# Altium schematic sheet rendszerterv.SchDoc
size A
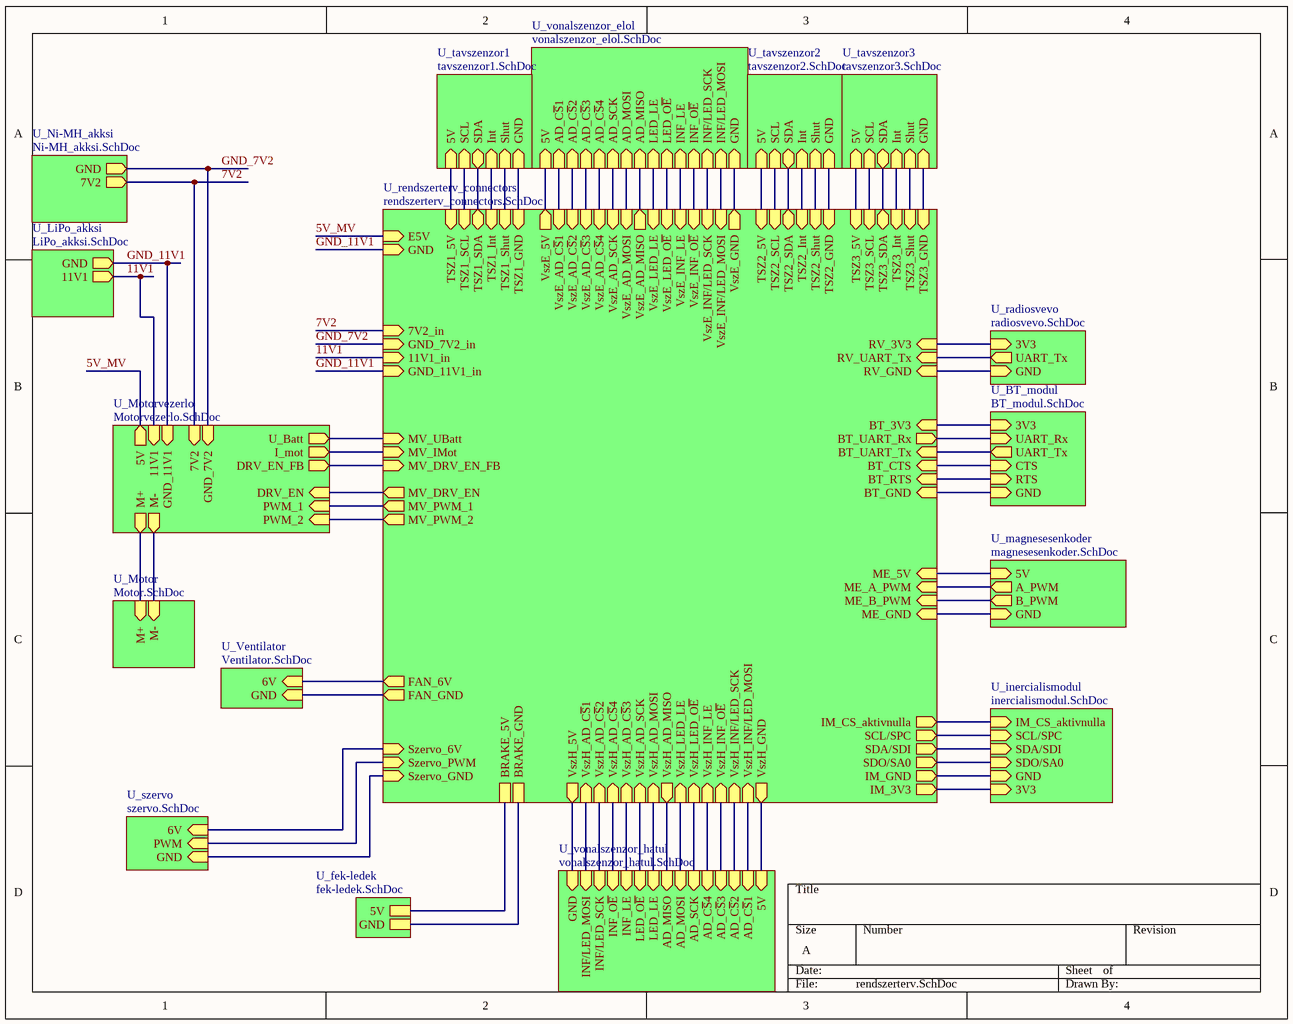
[diagram p0: rendszerterv.SchDoc]

## Sub-sheets
U_BT_modul = BT_modul.SchDoc: UART_Tx (out), UART_Rx (in), 3V3 (in), GND (in), CTS (in), RTS (in)
U_fek-ledek = fek-ledek.SchDoc: 5V, GND
U_inercialismodul = inercialismodul.SchDoc: IM_CS_aktivnulla (in), SCL/SPC (in), SDA/SDI (in), SDO/SA0 (in), GND (in), 3V3 (in)
U_LiPo_akksi = LiPo_akksi.SchDoc: GND (out), 11V1 (out)
U_magnesesenkoder = magnesesenkoder.SchDoc: 5V (in), GND (in), A_PWM (out), B_PWM (out)
U_Motor = Motor.SchDoc: M+ (in), M- (in)
U_Motorvezerlo = Motorvezerlo.SchDoc: 7V2 (in), GND_7V2 (in), 11V1 (in), GND_11V1 (in), 5V (out), U_Batt (out), I_mot (out), DRV_EN_FB (out), DRV_EN (in), PWM_1 (in), PWM_2 (in), M+ (out), M- (out)
U_Ni-MH_akksi = Ni-MH_akksi.SchDoc: 7V2 (out), GND (out)
U_radiosvevo = radiosvevo.SchDoc: 3V3 (in), GND (in), UART_Tx (out)
U_rendszerterv_connectors = rendszerterv_connectors.SchDoc: E5V (in), GND (in), MV_DRV_EN (out), MV_PWM_1 (out), MV_PWM_2 (out), MV_UBatt (in), MV_IMot (in), MV_DRV_EN_FB (in), FAN_6V (out), Szervo_PWM (in), Szervo_GND (in), ME_5V (in), ME_GND (in), ME_A_PWM (in), ME_B_PWM (in), Szervo_6V (in), VszE_5V (out), VszE_AD_C~{S}1 (in), VszE_AD_C~{S}2 (in), VszE_AD_C~{S}3 (in), VszE_AD_C~{S}4 (in), VszE_AD_SCK (in), VszE_AD_MOSI (in), VszE_AD_MISO (out), VszE_LED_LE (in), VszE_LED_O~{E} (in), VszE_INF_LE (in), VszE_INF_O~{E} (in), VszE_INF/LED_SCK (in), VszE_INF/LED_MOSI (in), TSZ1_5V (in), TSZ1_GND (in), TSZ1_SCL (in), TSZ1_SDA (bidir), TSZ1_Int (in), TSZ1_Shut (in), TSZ2_5V (in), TSZ2_GND (in), TSZ2_SCL (in), TSZ2_SDA (bidir), TSZ2_Int (in), TSZ2_Shut (in), TSZ3_5V (in), TSZ3_GND (in), TSZ3_SCL (in), TSZ3_SDA (bidir), TSZ3_Int (in), TSZ3_Shut (in), RV_3V3 (in), RV_GND (in), RV_UART_Tx (in), BT_UART_Tx (in), BT_UART_Rx (out), BT_3V3 (in), BT_GND (in), BT_CTS (in), BT_RTS (in), VszH_INF/LED_SCK (in), VszH_AD_C~{S}1 (in), VszH_AD_SCK (in), VszH_AD_MOSI (in), VszH_INF_O~{E} (in), VszH_INF_LE (in), VszH_AD_MISO (out), VszH_AD_C~{S}3 (in), VszH_AD_C~{S}2 (in), VszH_LED_O~{E} (in), VszH_LED_LE (in), VszH_INF/LED_MOSI (in), VszH_5V (out), VszH_AD_C~{S}4 (in), VszE_GND (out), VszH_GND (out), BRAKE_GND, BRAKE_5V, FAN_GND (out), IM_GND (out), IM_CS_aktivnulla (out), SCL/SPC (out), SDA/SDI (out), SDO/SA0 (out), IM_3V3 (out), 7V2_in (in), GND_7V2_in (in), 11V1_in (in), GND_11V1_in (in)
U_szervo = szervo.SchDoc: 6V (in), GND (in), PWM (in)
U_tavszenzor1 = tavszenzor1.SchDoc: 5V (in), GND (in), SCL (in), SDA (bidir), Int (in), Shut (in)
U_tavszenzor2 = tavszenzor2.SchDoc: 5V (in), GND (in), SCL (in), SDA (bidir), Int (in), Shut (in)
U_tavszenzor3 = tavszenzor3.SchDoc: 5V (in), GND (in), SCL (in), SDA (bidir), Int (in), Shut (in)
U_Ventilator = Ventilator.SchDoc: 6V (in), GND (in)
U_vonalszenzor_elol = vonalszenzor_elol.SchDoc: 5V (in), GND (in), AD_C~{S}1 (in), AD_C~{S}2 (in), AD_C~{S}3 (in), AD_C~{S}4 (in), AD_SCK (in), AD_MOSI (in), AD_MISO (in), LED_LE (in), LED_O~{E} (in), INF_LE (in), INF_O~{E} (in), INF/LED_SCK (in), INF/LED_MOSI (in)
U_vonalszenzor_hatul = vonalszenzor_hatul.SchDoc: 5V (in), GND (in), AD_C~{S}1 (in), AD_C~{S}2 (in), AD_C~{S}3 (in), AD_C~{S}4 (in), AD_SCK (in), AD_MOSI (in), AD_MISO (in), LED_LE (in), LED_O~{E} (in), INF_LE (in), INF_O~{E} (in), INF/LED_SCK (in), INF/LED_MOSI (in)

## Nets
5V_MV: sheet U_rendszerterv_connectors/E5V, sheet U_Motorvezerlo/5V
7V2: sheet U_Ni-MH_akksi/7V2, sheet U_rendszerterv_connectors/7V2_in, sheet U_Motorvezerlo/7V2
11V1: sheet U_LiPo_akksi/11V1, sheet U_rendszerterv_connectors/11V1_in, sheet U_Motorvezerlo/11V1
GND_7V2: sheet U_Ni-MH_akksi/GND, sheet U_rendszerterv_connectors/GND_7V2_in, sheet U_Motorvezerlo/GND_7V2
GND_11V1: sheet U_LiPo_akksi/GND, sheet U_rendszerterv_connectors/GND, sheet U_rendszerterv_connectors/GND_11V1_in, sheet U_Motorvezerlo/GND_11V1
(unnamed): sheet U_vonalszenzor_elol/5V, sheet U_rendszerterv_connectors/VszE_5V
(unnamed): sheet U_vonalszenzor_elol/GND, sheet U_rendszerterv_connectors/VszE_GND
(unnamed): sheet U_vonalszenzor_elol/AD_C~{S}1, sheet U_rendszerterv_connectors/VszE_AD_C~{S}1
(unnamed): sheet U_vonalszenzor_elol/AD_C~{S}2, sheet U_rendszerterv_connectors/VszE_AD_C~{S}2
(unnamed): sheet U_vonalszenzor_elol/AD_C~{S}3, sheet U_rendszerterv_connectors/VszE_AD_C~{S}3
(unnamed): sheet U_vonalszenzor_elol/AD_C~{S}4, sheet U_rendszerterv_connectors/VszE_AD_C~{S}4
(unnamed): sheet U_vonalszenzor_elol/AD_SCK, sheet U_rendszerterv_connectors/VszE_AD_SCK
(unnamed): sheet U_vonalszenzor_elol/AD_MOSI, sheet U_rendszerterv_connectors/VszE_AD_MOSI
(unnamed): sheet U_vonalszenzor_elol/AD_MISO, sheet U_rendszerterv_connectors/VszE_AD_MISO
(unnamed): sheet U_vonalszenzor_elol/LED_LE, sheet U_rendszerterv_connectors/VszE_LED_LE
(unnamed): sheet U_vonalszenzor_elol/LED_O~{E}, sheet U_rendszerterv_connectors/VszE_LED_O~{E}
(unnamed): sheet U_vonalszenzor_elol/INF_LE, sheet U_rendszerterv_connectors/VszE_INF_LE
(unnamed): sheet U_vonalszenzor_elol/INF_O~{E}, sheet U_rendszerterv_connectors/VszE_INF_O~{E}
(unnamed): sheet U_vonalszenzor_elol/INF/LED_SCK, sheet U_rendszerterv_connectors/VszE_INF/LED_SCK
(unnamed): sheet U_vonalszenzor_elol/INF/LED_MOSI, sheet U_rendszerterv_connectors/VszE_INF/LED_MOSI
(unnamed): sheet U_vonalszenzor_hatul/5V, sheet U_rendszerterv_connectors/VszH_GND
(unnamed): sheet U_vonalszenzor_hatul/GND, sheet U_rendszerterv_connectors/VszH_5V
(unnamed): sheet U_vonalszenzor_hatul/AD_C~{S}1, sheet U_rendszerterv_connectors/VszH_INF/LED_MOSI
(unnamed): sheet U_vonalszenzor_hatul/AD_C~{S}2, sheet U_rendszerterv_connectors/VszH_INF/LED_SCK
(unnamed): sheet U_vonalszenzor_hatul/AD_C~{S}3, sheet U_rendszerterv_connectors/VszH_INF_O~{E}
(unnamed): sheet U_vonalszenzor_hatul/AD_C~{S}4, sheet U_rendszerterv_connectors/VszH_INF_LE
(unnamed): sheet U_vonalszenzor_hatul/AD_SCK, sheet U_rendszerterv_connectors/VszH_LED_O~{E}
(unnamed): sheet U_vonalszenzor_hatul/AD_MOSI, sheet U_rendszerterv_connectors/VszH_LED_LE
(unnamed): sheet U_vonalszenzor_hatul/AD_MISO, sheet U_rendszerterv_connectors/VszH_AD_MISO
(unnamed): sheet U_vonalszenzor_hatul/LED_LE, sheet U_rendszerterv_connectors/VszH_AD_MOSI
(unnamed): sheet U_vonalszenzor_hatul/LED_O~{E}, sheet U_rendszerterv_connectors/VszH_AD_SCK
(unnamed): sheet U_vonalszenzor_hatul/INF_LE, sheet U_rendszerterv_connectors/VszH_AD_C~{S}3
(unnamed): sheet U_vonalszenzor_hatul/INF_O~{E}, sheet U_rendszerterv_connectors/VszH_AD_C~{S}4
(unnamed): sheet U_vonalszenzor_hatul/INF/LED_SCK, sheet U_rendszerterv_connectors/VszH_AD_C~{S}2
(unnamed): sheet U_vonalszenzor_hatul/INF/LED_MOSI, sheet U_rendszerterv_connectors/VszH_AD_C~{S}1
(unnamed): sheet U_BT_modul/UART_Tx, sheet U_rendszerterv_connectors/BT_UART_Tx
(unnamed): sheet U_BT_modul/UART_Rx, sheet U_rendszerterv_connectors/BT_UART_Rx
(unnamed): sheet U_BT_modul/3V3, sheet U_rendszerterv_connectors/BT_3V3
(unnamed): sheet U_BT_modul/GND, sheet U_rendszerterv_connectors/BT_GND
(unnamed): sheet U_BT_modul/CTS, sheet U_rendszerterv_connectors/BT_CTS
(unnamed): sheet U_BT_modul/RTS, sheet U_rendszerterv_connectors/BT_RTS
(unnamed): sheet U_magnesesenkoder/5V, sheet U_rendszerterv_connectors/ME_5V
(unnamed): sheet U_magnesesenkoder/GND, sheet U_rendszerterv_connectors/ME_GND
(unnamed): sheet U_magnesesenkoder/A_PWM, sheet U_rendszerterv_connectors/ME_A_PWM
(unnamed): sheet U_magnesesenkoder/B_PWM, sheet U_rendszerterv_connectors/ME_B_PWM
(unnamed): sheet U_szervo/6V, sheet U_rendszerterv_connectors/Szervo_6V
(unnamed): sheet U_szervo/GND, sheet U_rendszerterv_connectors/Szervo_GND
(unnamed): sheet U_szervo/PWM, sheet U_rendszerterv_connectors/Szervo_PWM
(unnamed): sheet U_radiosvevo/3V3, sheet U_rendszerterv_connectors/RV_3V3
(unnamed): sheet U_radiosvevo/GND, sheet U_rendszerterv_connectors/RV_GND
(unnamed): sheet U_radiosvevo/UART_Tx, sheet U_rendszerterv_connectors/RV_UART_Tx
(unnamed): sheet U_Ventilator/6V, sheet U_rendszerterv_connectors/FAN_6V
(unnamed): sheet U_Ventilator/GND, sheet U_rendszerterv_connectors/FAN_GND
(unnamed): sheet U_Motor/M+, sheet U_Motorvezerlo/M+
(unnamed): sheet U_Motor/M-, sheet U_Motorvezerlo/M-
(unnamed): sheet U_rendszerterv_connectors/MV_DRV_EN, sheet U_Motorvezerlo/DRV_EN
(unnamed): sheet U_rendszerterv_connectors/MV_PWM_1, sheet U_Motorvezerlo/PWM_1
(unnamed): sheet U_rendszerterv_connectors/MV_PWM_2, sheet U_Motorvezerlo/PWM_2
(unnamed): sheet U_rendszerterv_connectors/MV_UBatt, sheet U_Motorvezerlo/U_Batt
(unnamed): sheet U_rendszerterv_connectors/MV_IMot, sheet U_Motorvezerlo/I_mot
(unnamed): sheet U_rendszerterv_connectors/MV_DRV_EN_FB, sheet U_Motorvezerlo/DRV_EN_FB
(unnamed): sheet U_rendszerterv_connectors/TSZ1_5V, sheet U_tavszenzor1/5V
(unnamed): sheet U_rendszerterv_connectors/TSZ1_GND, sheet U_tavszenzor1/GND
(unnamed): sheet U_rendszerterv_connectors/TSZ1_SCL, sheet U_tavszenzor1/SCL
(unnamed): sheet U_rendszerterv_connectors/TSZ1_SDA, sheet U_tavszenzor1/SDA
(unnamed): sheet U_rendszerterv_connectors/TSZ1_Int, sheet U_tavszenzor1/Int
(unnamed): sheet U_rendszerterv_connectors/TSZ1_Shut, sheet U_tavszenzor1/Shut
(unnamed): sheet U_rendszerterv_connectors/TSZ2_5V, sheet U_tavszenzor2/5V
(unnamed): sheet U_rendszerterv_connectors/TSZ2_GND, sheet U_tavszenzor2/GND
(unnamed): sheet U_rendszerterv_connectors/TSZ2_SCL, sheet U_tavszenzor2/SCL
(unnamed): sheet U_rendszerterv_connectors/TSZ2_SDA, sheet U_tavszenzor2/SDA
(unnamed): sheet U_rendszerterv_connectors/TSZ2_Int, sheet U_tavszenzor2/Int
(unnamed): sheet U_rendszerterv_connectors/TSZ2_Shut, sheet U_tavszenzor2/Shut
(unnamed): sheet U_rendszerterv_connectors/TSZ3_5V, sheet U_tavszenzor3/5V
(unnamed): sheet U_rendszerterv_connectors/TSZ3_GND, sheet U_tavszenzor3/GND
(unnamed): sheet U_rendszerterv_connectors/TSZ3_SCL, sheet U_tavszenzor3/SCL
(unnamed): sheet U_rendszerterv_connectors/TSZ3_SDA, sheet U_tavszenzor3/SDA
(unnamed): sheet U_rendszerterv_connectors/TSZ3_Int, sheet U_tavszenzor3/Int
(unnamed): sheet U_rendszerterv_connectors/TSZ3_Shut, sheet U_tavszenzor3/Shut
(unnamed): sheet U_rendszerterv_connectors/BRAKE_GND, sheet U_fek-ledek/GND
(unnamed): sheet U_rendszerterv_connectors/BRAKE_5V, sheet U_fek-ledek/5V
(unnamed): sheet U_rendszerterv_connectors/IM_GND, sheet U_inercialismodul/GND
(unnamed): sheet U_rendszerterv_connectors/IM_CS_aktivnulla, sheet U_inercialismodul/IM_CS_aktivnulla
(unnamed): sheet U_rendszerterv_connectors/SCL/SPC, sheet U_inercialismodul/SCL/SPC
(unnamed): sheet U_rendszerterv_connectors/SDA/SDI, sheet U_inercialismodul/SDA/SDI
(unnamed): sheet U_rendszerterv_connectors/SDO/SA0, sheet U_inercialismodul/SDO/SA0
(unnamed): sheet U_rendszerterv_connectors/IM_3V3, sheet U_inercialismodul/3V3